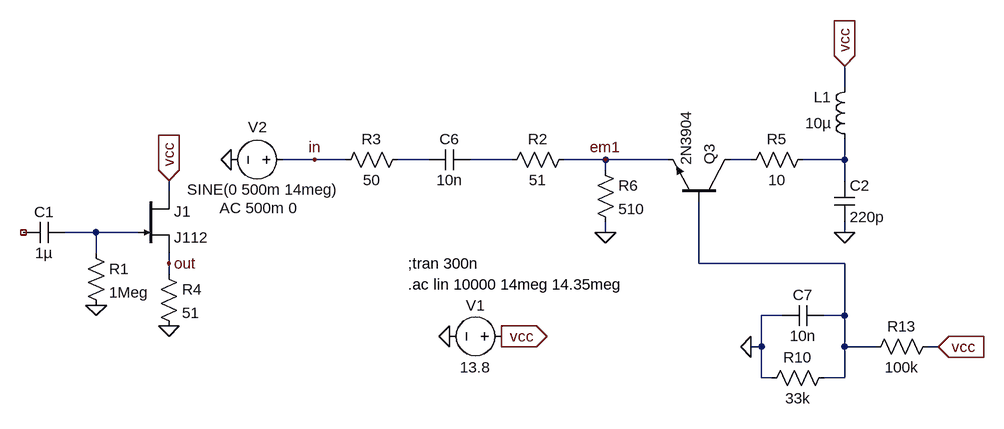
[diagram p0: schematic shifter-int.asc]
shifter-int.asc, the LTspice schematic file:
Version 4
SHEET 1 3080 1188
WIRE 1392 688 1392 656
WIRE 576 800 528 800
WIRE 624 800 576 800
WIRE 752 800 704 800
WIRE 880 800 816 800
WIRE 1024 800 960 800
WIRE 1120 800 1024 800
WIRE 1248 800 1216 800
WIRE 1392 800 1392 768
WIRE 1392 800 1328 800
WIRE 1024 816 1024 800
WIRE 1392 832 1392 800
WIRE 352 848 352 832
WIRE 240 912 192 912
WIRE 304 912 240 912
WIRE 1024 912 1024 896
WIRE 1392 912 1392 896
WIRE 240 944 240 912
WIRE 352 960 352 944
WIRE 1168 960 1168 864
WIRE 1392 960 1168 960
WIRE 352 976 352 960
WIRE 1296 1040 1264 1040
WIRE 1392 1040 1392 960
WIRE 1392 1040 1360 1040
WIRE 1264 1088 1264 1040
WIRE 1264 1088 1248 1088
WIRE 1392 1088 1392 1040
WIRE 1440 1088 1392 1088
WIRE 1536 1088 1520 1088
WIRE 1264 1136 1264 1088
WIRE 1280 1136 1264 1136
WIRE 1392 1136 1392 1088
WIRE 1392 1136 1360 1136
FLAG 864 1072 vcc
IOPIN 864 1072 Out
FLAG 784 1072 0
FLAG 448 800 0
FLAG 576 800 in
FLAG 1024 800 em1
FLAG 1024 912 0
FLAG 1248 1088 0
FLAG 1536 1088 vcc
IOPIN 1536 1088 In
FLAG 1392 656 vcc
IOPIN 1392 656 In
FLAG 240 1024 0
FLAG 352 832 vcc
IOPIN 352 832 In
FLAG 352 1056 0
FLAG 352 960 out
FLAG 1392 912 0
SYMBOL voltage 880 1072 R90
WINDOW 0 -32 56 VBottom 2
WINDOW 3 32 56 VTop 2
WINDOW 123 0 0 Left 0
WINDOW 39 0 0 Left 0
SYMATTR InstName V1
SYMATTR Value 13.8
SYMBOL voltage 544 800 R90
WINDOW 0 -50 41 VRight 2
WINDOW 3 46 -70 VRight 2
WINDOW 123 74 -7 VRight 2
WINDOW 39 0 0 Left 0
SYMATTR InstName V2
SYMATTR Value SINE(0 500m 14meg)
SYMATTR Value2 AC 500m 0
SYMBOL cap 816 784 R90
WINDOW 0 0 32 VBottom 2
WINDOW 3 32 32 VTop 2
SYMATTR InstName C6
SYMATTR Value 10n
SYMBOL npn 1216 864 M270
SYMATTR InstName Q3
SYMATTR Value 2N3904
SYMBOL res 1008 800 R0
SYMATTR InstName R6
SYMATTR Value 510
SYMBOL res 1376 1120 R90
WINDOW 0 0 56 VBottom 2
WINDOW 3 32 56 VTop 2
SYMATTR InstName R10
SYMATTR Value 33k
SYMBOL cap 1360 1024 R90
WINDOW 0 0 32 VBottom 2
WINDOW 3 32 32 VTop 2
SYMATTR InstName C7
SYMATTR Value 10n
SYMBOL res 1424 1104 R270
WINDOW 0 32 56 VTop 2
WINDOW 3 0 56 VBottom 2
SYMATTR InstName R13
SYMATTR Value 100k
SYMBOL res 224 928 R0
SYMATTR InstName R1
SYMATTR Value 1Meg
SYMBOL njf 304 848 R0
SYMATTR InstName J1
SYMATTR Value J112
SYMBOL res 336 960 R0
SYMATTR InstName R4
SYMATTR Value 51
SYMBOL cap 192 896 R90
WINDOW 0 0 32 VBottom 2
WINDOW 3 32 32 VTop 2
SYMATTR InstName C1
SYMATTR Value 1µ
SYMBOL res 976 784 R90
WINDOW 0 0 56 VBottom 2
WINDOW 3 32 56 VTop 2
SYMATTR InstName R2
SYMATTR Value 51
SYMBOL ind 1408 784 R180
WINDOW 0 36 80 Left 2
WINDOW 3 36 40 Left 2
SYMATTR InstName L1
SYMATTR Value 10µ
SYMBOL cap 1376 832 R0
SYMATTR InstName C2
SYMATTR Value 220p
SYMBOL res 720 784 R90
WINDOW 0 0 56 VBottom 2
WINDOW 3 32 56 VTop 2
SYMATTR InstName R3
SYMATTR Value 50
SYMBOL res 1344 784 R90
WINDOW 0 0 56 VBottom 2
WINDOW 3 32 56 VTop 2
SYMATTR InstName R5
SYMATTR Value 10
TEXT 720 992 Left 2 !.ac lin 10000 14meg 14.35meg
TEXT 720 960 Left 2 !;tran 300n

The netlist it stands for:
* shifter-int.asc
V1 vcc 0 13.8
V2 in 0 SINE(0 500m 14meg) AC 500m 0
C6 N002 N001 10n
Q3 N003 N006 em1 0 2N3904
R6 em1 0 510
R10 N006 0 33k
C7 N006 0 10n
R13 N006 vcc 100k
R1 N005 0 1Meg
J1 vcc N005 out J112
R4 out 0 51
C1 N005 NC_01 1µ
R2 em1 N002 51
L1 N004 vcc 10µ
C2 N004 0 220p
R3 N001 in 50
R5 N004 N003 10
.model NPN NPN
.model PNP PNP
.lib standard.bjt
.model NJF NJF
.model PJF PJF
.lib standard.jft
.ac lin 10000 14meg 14.35meg
;tran 300n
.backanno
.end